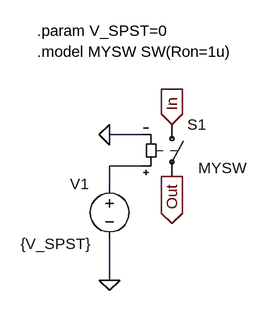
[diagram p0: schematic 1PST.asc]
1PST.asc, the LTspice schematic file:
Version 4
SHEET 1 880 680
WIRE 160 336 112 336
WIRE 160 384 112 384
WIRE 112 416 112 384
WIRE 112 560 112 496
FLAG 208 320 In
IOPIN 208 320 In
FLAG 208 400 Out
IOPIN 208 400 Out
FLAG 112 336 0
FLAG 112 560 0
SYMBOL sw 208 304 R0
WINDOW 3 41 83 Left 2
SYMATTR Value MYSW
SYMATTR InstName S1
SYMBOL voltage 112 400 R0
WINDOW 0 -61 12 Left 2
WINDOW 3 -137 104 Left 2
WINDOW 123 0 0 Left 0
WINDOW 39 0 0 Left 0
SYMATTR InstName V1
SYMATTR Value {V_SPST}
TEXT 0 176 Left 2 !.param V_SPST=0
TEXT 0 208 Left 2 !.model MYSW SW(Ron=1u)

The netlist it stands for:
* 1PST.asc
S1 In Out N001 0 MYSW
V1 N001 0 {V_SPST}
.param V_SPST=0
.model MYSW SW(Ron=1u)
.backanno
.end